# EasyEDA Pro project ProDoc_主板-2026-03-25.epro

# Schematic Schematic1
Board Name: Board1; Create Date: 2026-01-07; Page Name: P1; Project Name: 主板-智能视觉; Schematic Name: Schematic1; Update Date: 2026-02-09; Company: 嘉立创EDA; Page Size: A4; Version: V1.0
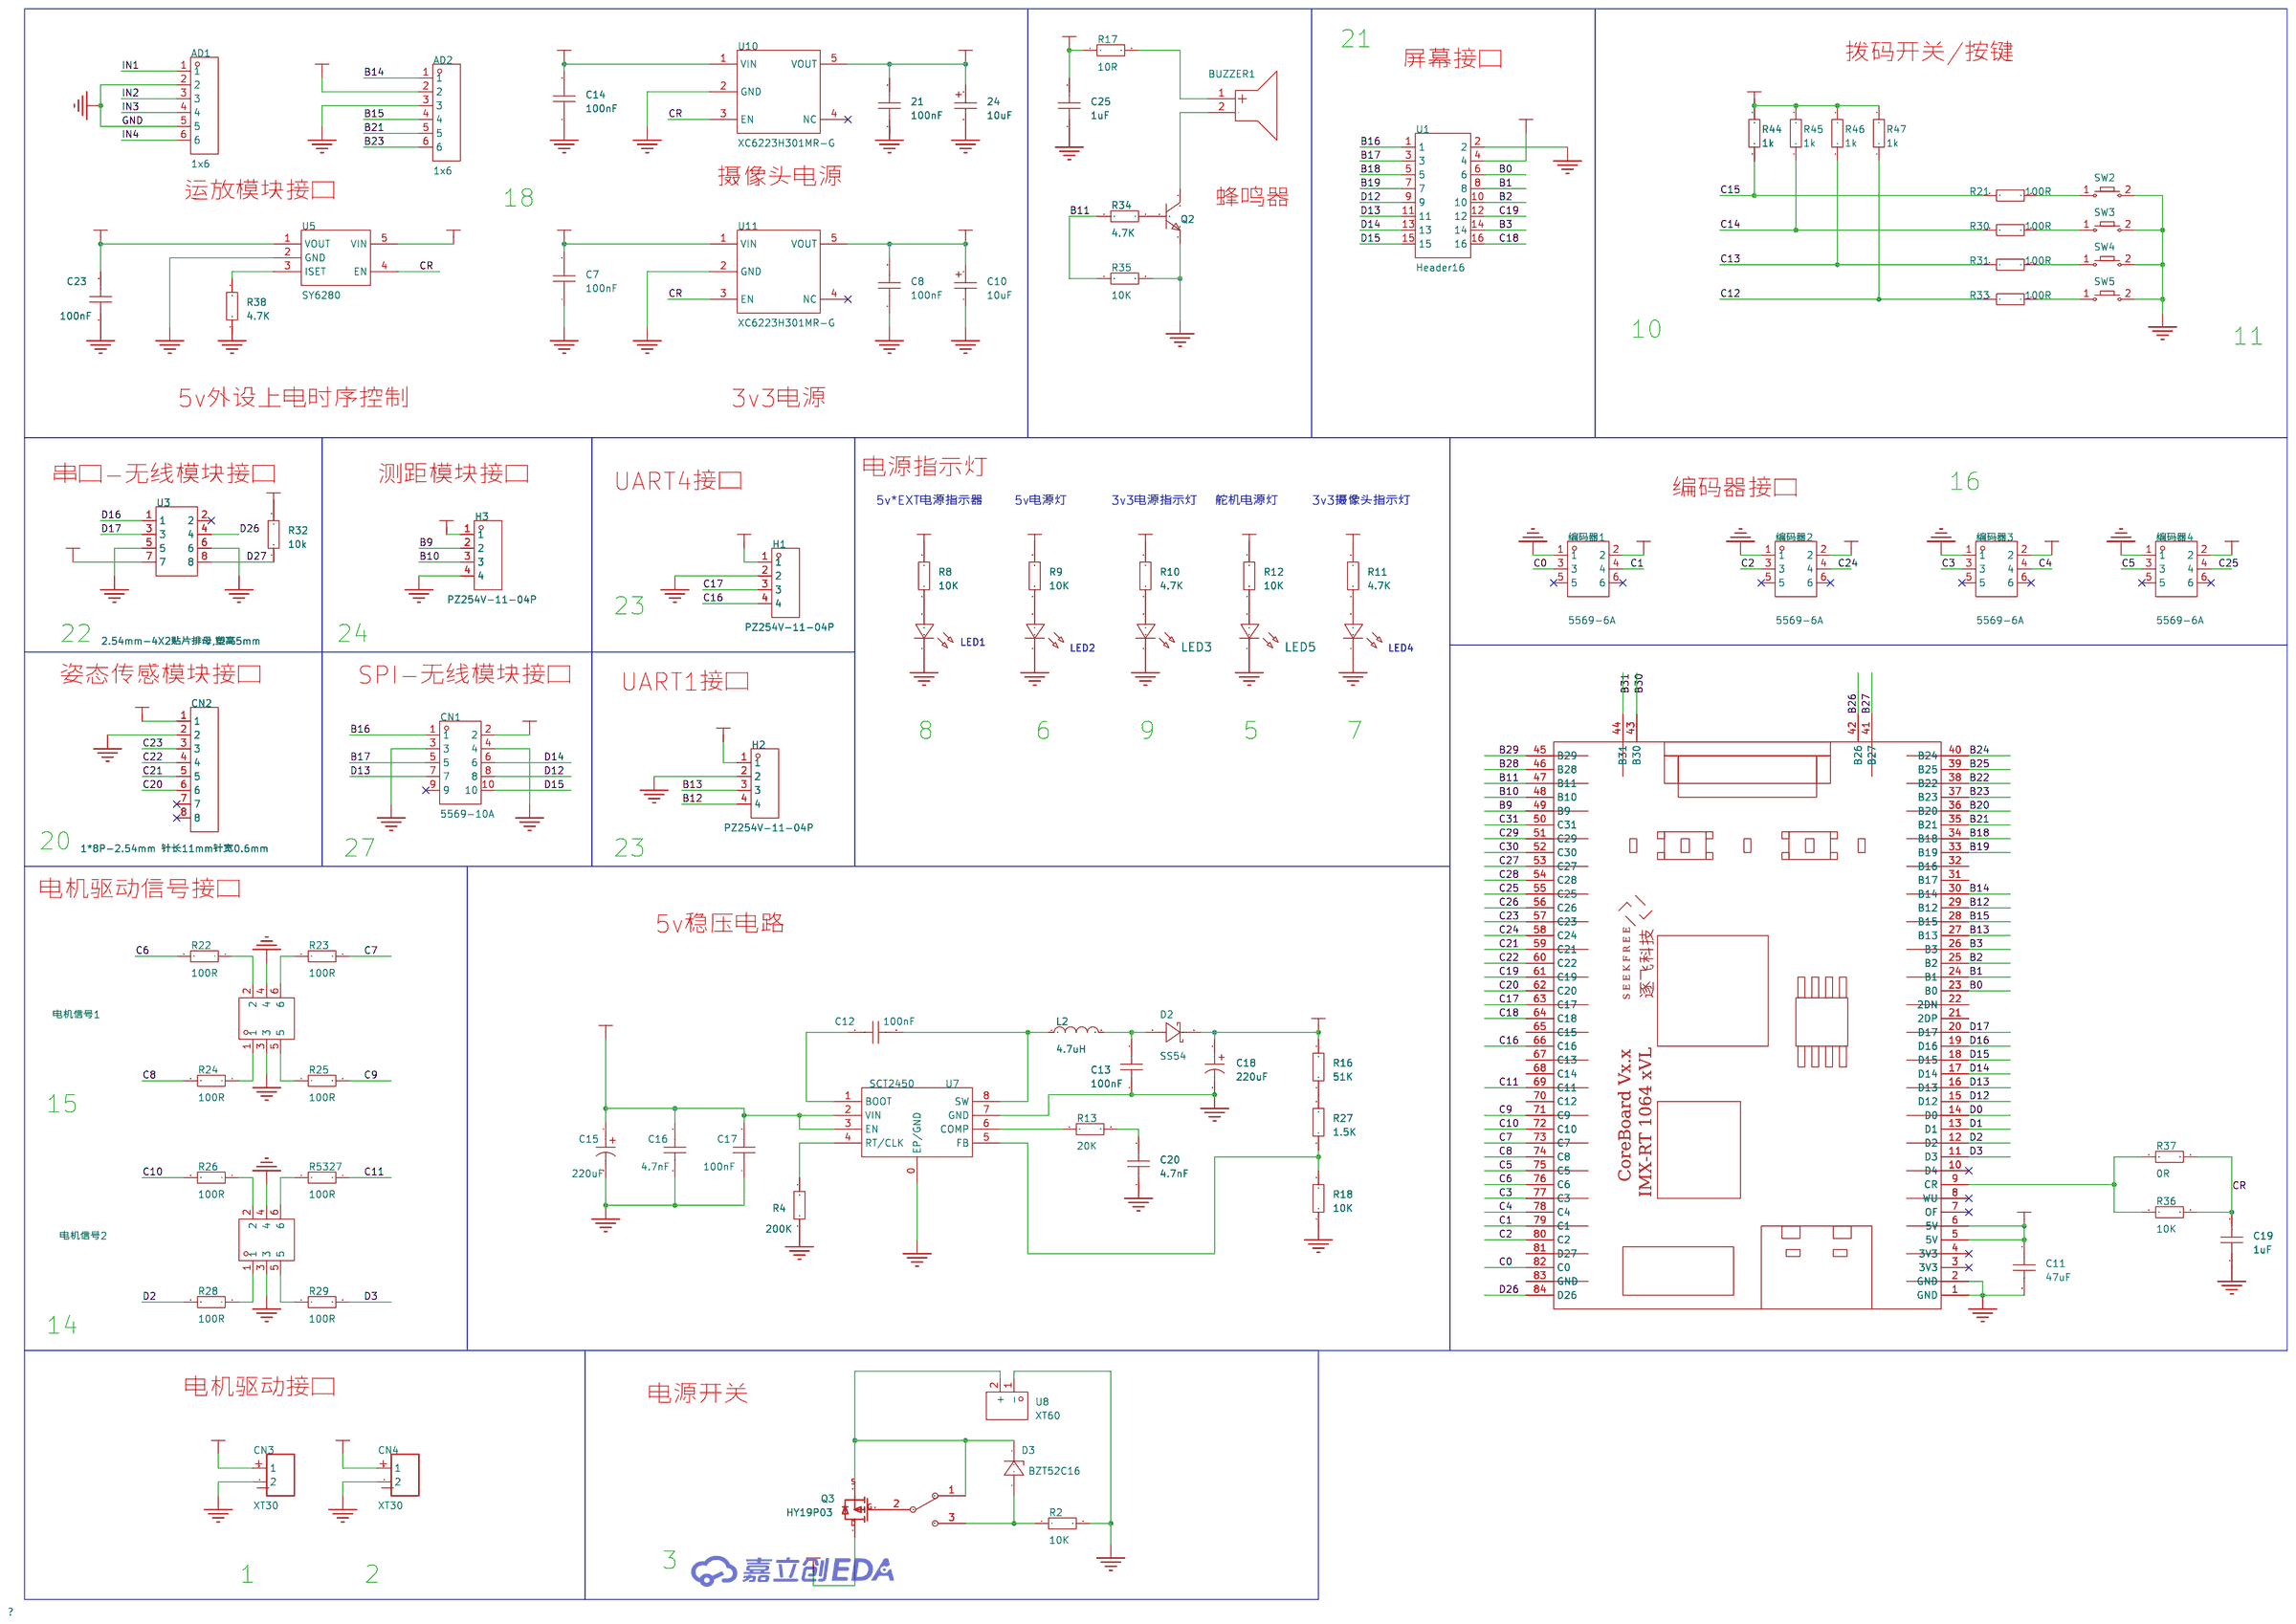
[diagram p0: schematic sheet]

## Parts
21  100nF  [C0603]
24  10uF  [CAP-SMD_L3.2-W1.6-RD-C7171]
AD1  1x6  [HDR-TH_6P-P2.54-V-F]
AD2  1x6  [HDR-TH_6P-P2.54-V-F]
BUZZER1  5V,管脚间距8mm,外径10mm,高9.5mm  [BUZ-TH_BD12.0-P7.60-D0.6-FD]
C7  100nF  [C0603]
C8  100nF  [C0603]
C10  10uF  [CAP-SMD_L3.2-W1.6-RD-C7171]
C11  47uF  [C0603]
C12  100nF  [C0603]
C13  100nF  [C1206]
C14  100nF  [C0603]
C15  220uF  [CAP-SMD_BD8.0-L8.3-W8.3-LS9.0-FD]
C16  4.7nF  [C1206]
C17  100nF  [C0603]
C18  220uF  [CAP-SMD_BD8.0-L8.3-W8.3-LS9.0-FD]
C19  1uF  [C0603]
C20  4.7nF  [C0603]
C23  100nF  [C0603]
C25  1uF  [C0603]
CN1  5569-10A  [CONN-TH_10P-P4.20_5569-10A]
CN2  1*8P-2.54mm 针长11mm针宽0.6mm  [HDR-TH_8P-P2.54-V-F-S2.54]
CN3  XT30  [XT30 -WS母头]
CN4  XT30  [XT30 -WS母头]
D2  SS54  [SMA_L4.2-W2.6-LS5.1-RD]
D3  BZT52C16  [SOD-123-L]
H1  PZ254V-11-04P  [HDR-TH_4P-P2.54-V-M]
H2  PZ254V-11-04P  [HDR-TH_4P-P2.54-V-M]
H3  PZ254V-11-04P  [HDR-TH_4P-P2.54-V-M]
L2  4.7uH  [IND-SMD_L7.1-W6.6_POHS0603]
LED1  -  [LED_0603]
LED2  -  [LED_0603]
LED3  -  [LED_0603]
LED4  -  [LED_0603]
LED5  -  [LED_0603]
Q2  -  [S8050_TO_92]
Q3  HY19P03  [TO-252AA]
R2  10K  [R0603]
R4  200K  [R0603]
R8  10K  [R0603]
R9  10K  [R0603]
R10  4.7K  [R0603]
R11  4.7K  [R0603]
R12  10K  [R0603]
R13  20K  [R0603]
R16  51K  [R0603]
R17  10R  [R0603]
R18  10K  [R0603]
R21  100Ω ±1% 62.5mW  [R0402]
R22  100Ω ±1% 62.5mW  [R0402]
R23  100Ω ±1% 62.5mW  [R0402]
R24  100Ω ±1% 62.5mW  [R0402]
R25  100Ω ±1% 62.5mW  [R0402]
R26  100Ω ±1% 62.5mW  [R0402]
R27  1.5K  [R0603]
R28  100Ω ±1% 62.5mW  [R0402]
R29  100Ω ±1% 62.5mW  [R0402]
R30  100Ω ±1% 62.5mW  [R0402]
R31  100Ω ±1% 62.5mW  [R0402]
R32  10k  [R0603]
R33  100Ω ±1% 62.5mW  [R0402]
R34  4.7K  [R0603]
R35  10K  [R0603]
R36  10K  [R0603]
R37  0R  [R0603]
R38  4.7K  [R0603]
R44  1k  [R0603]
R45  1k  [R0603]
R46  1k  [R0603]
R47  1k  [R0603]
R5327  100Ω ±1% 62.5mW  [R0402]
SW2  -  [Key_SMD_3x4x2]
SW3  -  [Key_SMD_3x4x2]
SW4  -  [Key_SMD_3x4x2]
SW5  -  [Key_SMD_3x4x2]
SW6  拨码开关  [3PIN2档拨动开关]
U1  Header16  [CONN-TH_16P-P2.50_C9900044747]
U3  2.54mm-4X2贴片排母,塑高5mm  [HDR-SMD_8P-P2.54-V-F-R2-C4-S7.1]
U5  SY6280  [SOT-23-5]
U7  SCT2450  [SOP-8E]
U8  XT60  [CONN-TH_XT60]
U10  XC6223H301MR-G  [SOT_235]
U11  XC6223H301MR-G  [SOT_235]
U?1  -  [AUFE_RT1064]
电机信号1  5569-6A  [CONN-TH_6P-P4.20_5569-6A-1]
电机信号2  5569-6A  [CONN-TH_6P-P4.20_5569-6A-1]
编码器1  5569-6A  [CONN-TH_6P-P4.20_5569-6A-1]
编码器2  5569-6A  [CONN-TH_6P-P4.20_5569-6A-1]
编码器3  5569-6A  [CONN-TH_6P-P4.20_5569-6A-1]
编码器4  5569-6A  [CONN-TH_6P-P4.20_5569-6A-1]

## Library data of the parts
21 C7 C8 C11 C12 C14 C17 C19 C20 C23 C25 = CAP_0603: Supplier Footprint: 0603
24 C10 = TAJA106K016RNJ: 容值:10uF;精度:±10%;额定电压:16V;等效串联电阻(ESR):3Ω@100kHz;; LCSC Part Name: 10uF ±10% 16V; Supplier Part: C7171; Manufacturer: Kyocera AVX; Supplier Footprint: CASE-A-3216-18(mm); JLCPCB Part Class: 基础库; Supplier: LCSC; Tolerance: ±10%; Voltage Rating: 16V; Equivalent Series Resistance(ESR): 3Ω@100kHz; Operating Temperature: -55℃~+125℃
AD1 AD2 = 1x6: Supplier: LCSC; Manufacturer: BOOMELE; Manufacturer Part: Female header 1*6p; Supplier Part: C40877; JLCPCB Part Class: Extended Part
BUZZER1 = 5V,管脚间距8mm,外径10mm,高9.5mm: Supplier Part: C9900017013; Supplier Footprint: BEEP; JLCPCB Part Class: 扩展库; Supplier: LCSC
C13 C16 = CAP_1206: Supplier Footprint: 1206
C15 C18 = RYRVT25V220UF8*10: 容值:220uF;精度:±20%;额定电压:25V;纹波电流:183mA@120Hz;; LCSC Part Name: 220uF ±20% 25V; Supplier Part: C48970746; Manufacturer: HONOR(荣誉); Supplier Footprint: SMD,D8xL10.2mm; JLCPCB Part Class: 扩展库; Datasheet: https://item.szlcsc.com/datasheet/RYRVT25V220UF8*10/51295690.html; Supplier: LCSC; Tolerance: ±20%; Voltage Rating: 25V; Ripple Current: 183mA@120Hz; Diameter: 8mm; Height - Seated (Max): 10.2mm; Lifetime: 2000hrs@105℃; Operating Temperature: -55℃~+105℃
CN1 = 5569-10A: Supplier Part: C9900070524; Supplier Footprint: 2*5p; JLCPCB Part Class: Extended Part; Supplier: LCSC
CN2 = 1*8P-2.54mm 针长11mm针宽0.6mm: Supplier Part: C9900024110; Supplier Footprint: 1*8P-2.54mm; JLCPCB Part Class: 扩展库; Supplier: LCSC
CN3 CN4 = XT30: Supplier: LCSC; Supplier Part: C108769; Manufacturer: Changzhou Amass Elec; Manufacturer Part: XT30UPB-F; nameAlias: Value; Contributor: LCSC; spicePre: C; spiceSymbolName: XT30UPB-F; Origin Footprint 2: XT30 -ls公头; Origin Footprint 3: XT30 -WS公头; Origin Footprint 4: XT30 -LS母头
D2 = SS54: Supplier Part: C9900023219; Supplier Footprint: (1N5824)DO-214; JLCPCB Part Class: 扩展库; Supplier: LCSC
D3 = BZT52C16: Published: 8-Jun-2000; Revision: July-2002: Re-released for DXP Platform.; Publisher: Altium Limited; Price(RMB): 0.000; Origin Footprint 2: DIODE-0.7; Origin Footprint 3: DIODE-0.4; Origin Footprint 4: SOD-87[LL-41]; Origin Footprint 5: CD4521-1808; Origin Footprint 6: SOD-80[LL-34]; Origin Footprint 7: SOD-123-FL; Origin Footprint 8: SOD-123-M; Origin Footprint 9: SOD-323; Origin Footprint 10: SOD-523-L; Origin Footprint 11: SOD-523-M
H1-H3 = PZ254V-11-04P: 插针结构:1x4P;间距:2.54mm;行距:-;圆针/方针:方针;安装方式:直插;排数:单排;总PIN位数:4P;额定电流:3A;额定电压:250V;配合针长度:6mm;塑高:2.5mm;端接针长度:3mm;触头材质:-;工作温度:-40℃~+105℃;颜色:黑色;; LCSC Part Name: 1x4P 间距:2.54mm 方针 直插; Supplier Part: C2691448; Manufacturer: XFCN(兴飞); Supplier Footprint: 插件,P=2.54mm; JLCPCB Part Class: 扩展库; Datasheet: https://item.szlcsc.com/datasheet/PZ254V-11-04P/2801085.html; Supplier: LCSC; Pin Structure: 1x4P; Pitch: 2.54mm; Circluar Pins/Square Pins: 方针; Mounting Type: 直插; Number of Rows: 单排; Number of Pins: 4P; Current Rating: 3A; Voltage Rating (Max): 250V; Length of Mating Pin: 6mm; Insulation Height: 2.5mm; Length of End Connection Pin: 3mm; Operating Temperature: -40℃~+105℃; Color: 黑色
L2 = POHS0603-4R7M: 电感值:4.7uH;精度:±20%;额定电流:5A;饱和电流(Isat):8A;类型:一体成型电感;; LCSC Part Name: 功率电感; Supplier Part: C49333010; Manufacturer: HYHONGYEX(宏业); Supplier Footprint: SMD,7.1x6.6mm; JLCPCB Part Class: 扩展库; Datasheet: https://item.szlcsc.com/datasheet/POHS0603-4R7M/51817416.html; Supplier: LCSC; Tolerance: ±20%; Current Rating: 5A; Current - Saturation(Isat): 8A; DC Resistance(DCR): 40mΩ; Type: 一体成型电感
LED1 LED4 = LED_0603-G: Supplier Footprint: 0603
LED2 = LED_0603-B: Supplier Footprint: 0603
LED3 LED5 = LED_0603-R: Supplier Footprint: 0603
Q2 = S8050_TO_NPN: Supplier Footprint: TO-92
Q3 = HY19P03: HY19P03 P-Channel MOSFET; componentDisplayMode: -1
R2 R4 R8-R13 R16-R18 R27 R34-R38 = Res_0603: Supplier Footprint: 0603
R21-R26 R28-R31 R33 R5327 = 100Ω ±1% 62.5mW R0402: LCSC Part Name: 100Ω(1000) ±1% 编带; Supplier Part: C25076; Manufacturer: UNI-ROYAL(厚声); Manufacturer Part: 0402WGF1000TCE; Supplier Footprint: 0402; JLCPCB Part Class: Basic Part; Datasheet: https://atta.szlcsc.com/upload/public/pdf/source/20170920/C25076_1505901197574982707.pdf; Supplier: LCSC; ERP编码: 000
R32 R44-R47 = R-10K-1%: 电阻类型:厚膜电阻;阻值:10kΩ;精度:±1%;功率:100mW;工作电压:75V;温度系数:±100ppm/℃;; Manufacturer: UNI-ROYAL(厚声); Manufacturer Part: 0603WAF1002T5E; Supplier: LCSC; Supplier Part: C25804; LCSC Part Name: 厚膜电阻 10kΩ ±1% 100mW; Supplier Footprint: 0603; JLCPCB Part Class: Basic Part; Datasheet: https://atta.szlcsc.com/upload/public/pdf/source/20200306/C422600_1E6D84923E4A46A82E41ADD87F860B5C.pdf; Type: 厚膜电阻; Tolerance: ±1%; Power(Watts): 100mW; Voltage-Supply(Max): 75V; Temperature Coefficient: ±100ppm/℃; Operating Temperature: -55℃~+155℃
SW2-SW5 = Key_SMD_3x4x2: Supplier Footprint: SMD
SW6 = 拨码开关: Origin Footprint 1: TA-3524S-A2
U1 = Header16_C9900044747: Supplier Part: C9900044747; Supplier Footprint: TH-2*8P-2.54; JLCPCB Part Class: 扩展库; Supplier: LCSC
U3 = 2.54mm-4X2贴片排母,塑高5mm: Supplier Part: C9900015268; Supplier Footprint: BDM_SMD2.54-2*4; JLCPCB Part Class: 扩展库; Supplier: LCSC
U5 = SY6280: Published: 2020-12-08; Revision: V1.0; Imax: 2.1A
U7 = SCT2450
U8 = XT60: 模型锂电连接器; LCSC Part Name: XT60公头（电调端）; Supplier Part: C98733; Manufacturer: AMASS(艾迈斯); Supplier Footprint: XT60-M; JLCPCB Part Class: Extended Part; Datasheet: https://atta.szlcsc.com/upload/public/pdf/source/20170606/1496716524919.pdf; Supplier: LCSC
U10 U11 = XC6223H301MR-G: 存货编码: 1110404156; 存货名称: 集成电路
U?1 = RT1064: Supplier: seekfree
电机信号1 电机信号2 编码器1-编码器4 = 5569-6A: Supplier Part: C9900070523; Supplier Footprint: 2*3p; JLCPCB Part Class: Extended Part; Supplier: LCSC

## Nets
3V3: 21.2 24.1 AD2.2 C8.2 C10.1 C25.2 CN2.1 H3.1 R10.2 R17.1 R32.2 R44.2 R45.2 R46.2 R47.2 U1.4 U10.5(VOUT) U11.5(VOUT) 编码器1.2 编码器2.2 编码器3.2 编码器4.2
GND: 21.1 24.2 AD1.2 AD1.5 AD2.3 C7.1 C8.1 C10.2 C11.2 C13.1 C14.1 C15.2 C16.1 C17.1 C18.2 C19.1 C20.1 C23.1 C25.1 CN1.3 CN1.4 CN2.2 CN3.2 CN4.2 H1.2 H2.2 H3.4 LED1.1(C) LED2.1(C) LED3.1(C) LED4.1(C) LED5.1(C) Q2.1(E) R2.2 R4.1 R18.1 R35.2 R38.1 SW2.2 SW3.2 SW4.2 SW5.2 U1.2 U3.5 U3.6 U5.2(GND) U7.0(EP/GND) U7.7(GND) U8.1(-) U10.2(GND) U11.2(GND) U?1.1(GND) U?1.2(GND) 电机信号1.3 电机信号1.4 电机信号2.3 电机信号2.4 编码器1.1 编码器2.1 编码器3.1 编码器4.1
VCC-5V: C11.1 C18.1 D2.1(C) R9.2 R16.2 U5.5(VIN) U?1.5(5V) U?1.6(5V)
VCC-5V-EXT: C23.2 CN1.2 H1.1 H2.1 R8.2 U3.7 U5.1(VOUT)
VCC_5V: C7.2 C14.2 U10.1(VIN) U11.1(VIN)
VCC_SERVO: R12.2
VCCBAT: C15.1 C16.2 C17.2 CN3.1 CN4.1 Q3.1(D) U7.2(VIN) U7.3(EN)
B0: U1.6 U?1.23(B0)
B1: U1.8 U?1.24(B1)
B2: U1.10 U?1.25(B2)
B3: U1.14 U?1.26(B3)
B9: H3.2 U?1.49(B9)
B10: H3.3 U?1.48(B10)
B11: R34.1 R35.1 U?1.47(B11)
B12: H2.4 U?1.29(B12)
B13: H2.3 U?1.27(B13)
B14: AD2.1 U?1.30(B14)
B15: AD2.4 U?1.28(B15)
B16: CN1.1 U1.1
B17: CN1.5 U1.3
B18: U1.5 U?1.34(B18)
B19: U1.7 U?1.33(B19)
B20: U?1.36(B20)
B21: AD2.5 U?1.35(B21)
B22: U?1.38(B22)
B23: AD2.6 U?1.37(B23)
B24: U?1.40(B24)
B25: U?1.39(B25)
B26: U?1.42(B26)
B27: U?1.41(B27)
B28: U?1.46(B28)
B29: U?1.45(B29)
B30: U?1.43(B30)
B31: U?1.44(B31)
C0: U?1.82(C0) 编码器1.3
C1: U?1.79(C1) 编码器1.4
C2: U?1.80(C2) 编码器2.3
C3: U?1.77(C3) 编码器3.3
C4: U?1.78(C4) 编码器3.4
C5: U?1.75(C5) 编码器4.3
C6: R22.2 U?1.76(C6)
C7: R23.1 U?1.73(C7)
C8: R24.2 U?1.74(C8)
C9: R25.2 U?1.71(C9)
C10: R26.2 U?1.72(C10)
C11: R5327.1 U?1.69(C11)
C12: R33.2 R47.1
C13: R31.2 R46.1
C14: R30.2 R45.1
C15: R21.2 R44.1
C16: H1.4 U?1.66(C16)
C17: H1.3 U?1.63(C17)
C18: U1.16 U?1.64(C18)
C19: U1.12 U?1.61(C19)
C20: CN2.6 U?1.62(C20)
C21: CN2.5 U?1.59(C21)
C22: CN2.4 U?1.60(C22)
C23: CN2.3 U?1.57(C23)
C24: U?1.58(C24) 编码器2.4
C25: U?1.55(C25) 编码器4.4
C26: U?1.56(C26)
C27: U?1.53(C27)
C28: U?1.54(C28)
C29: U?1.51(C29)
C30: U?1.52(C30)
C31: U?1.50(C31)
CR: C19.2 R36.2 R37.2 U5.4(EN) U10.3(EN) U11.3(EN)
CSI-3V3: R11.2
D0: U?1.14(D0)
D1: U?1.13(D1)
D2: R28.2 U?1.12(D2)
D3: R29.2 U?1.11(D3)
D12: CN1.8 U1.9 U?1.15(D12)
D13: CN1.7 U1.11 U?1.16(D13)
D14: CN1.6 U1.13 U?1.17(D14)
D15: CN1.10 U1.15 U?1.18(D15)
D16: U3.1 U?1.19(D16)
D17: U3.3 U?1.20(D17)
D26: U3.4 U?1.84(D26)
D27: R32.1 U3.8
IN1: AD1.1
IN2: AD1.3
IN3: AD1.4
IN4: AD1.6
Net-(BUZZER1-1): BUZZER1.1(+) R17.2
Net-(BUZZER1-2): BUZZER1.2(-) Q2.3(C)
Net-(C12-1): C12.1 U7.1(BOOT)
Net-(C12-2): C12.2 L2.1 U7.8(SW)
Net-(C13-2): C13.2 D2.2(A) L2.2
Net-(C20-2): C20.2 R13.2
Net-(D3-A): D3.A R2.1 SW6.3
Net-(D3-K): D3.K Q3.3(S) SW6.1 U8.2(+)
Net-(LED1-2): LED1.2(A) R8.1
Net-(LED2-2): LED2.2(A) R9.1
Net-(LED3-2): LED3.2(A) R10.1
Net-(LED4-2): LED4.2(A) R11.1
Net-(LED5-2): LED5.2(A) R12.1
Net-(Q2-2): Q2.2(B) R34.2
Net-(Q3-2): Q3.2(G) SW6.2
Net-(R4-2): R4.2 U7.4(RT/CLK)
Net-(R13-1): R13.1 U7.6(COMP)
Net-(R16-1): R16.1 R27.2
Net-(R18-2): R18.2 R27.1 U7.5(FB)
Net-(R21-1): R21.1 SW2.1
Net-(R22-1): R22.1 电机信号1.2
Net-(R23-2): R23.2 电机信号1.6
Net-(R24-1): R24.1 电机信号1.1
Net-(R25-1): R25.1 电机信号1.5
Net-(R26-1): R26.1 电机信号2.2
Net-(R28-1): R28.1 电机信号2.1
Net-(R29-1): R29.1 电机信号2.5
Net-(R30-1): R30.1 SW3.1
Net-(R31-1): R31.1 SW4.1
Net-(R33-1): R33.1 SW5.1
Net-(R36-1): R36.1 R37.1 U?1.9(CR)
Net-(R38-2): R38.2 U5.3(ISET)
Net-(R5327-2): R5327.2 电机信号2.6

Not connected (* = marked no-connect by the designer): CN1 9*; CN2 7* 8*; U3 2*; U10 4(NC)*; U11 4(NC)*; U?1 3(3V3)* 4(3V3)* 7(OF)* 8(WU)* 10(D4)* 21(2DP) 22(2DN) 31(B17) 32(B16) 65(C15) 67(C13) 68(C14) 70(C12) 81(D27) 83(GND); 编码器1 5* 6*; 编码器2 5* 6*; 编码器3 5* 6*; 编码器4 5* 6*

## Notes on the sheet
- 21
- 拨码开关/按键
- 屏幕接口
- 摄像头电源
- 运放模块接口
- 18
- 蜂鸣器
- 10
- 11
- 5v外设上电时序控制
- 3v3电源
- 串口-无线模块接口
- 测距模块接口
- 电源指示灯
- UART4接口
- 5v*EXT电源指示器
- 5v电源灯
- 3v3电源指示灯
- 舵机电源灯
- 3v3摄像头指示灯
- 编码器接口
- 16
- 23
- 22
- 24
- 姿态传感模块接口
- SPI-无线模块接口
- UART1接口
- 8
- 6
- 9
- 5
- 7
- 20
- 27
- 23
- 电机驱动信号接口
- 5v稳压电路
- 15
- 14
- 电机驱动接口
- 电源开关
- 3
- 1
- 2
